# Altium project project.PrjPcb
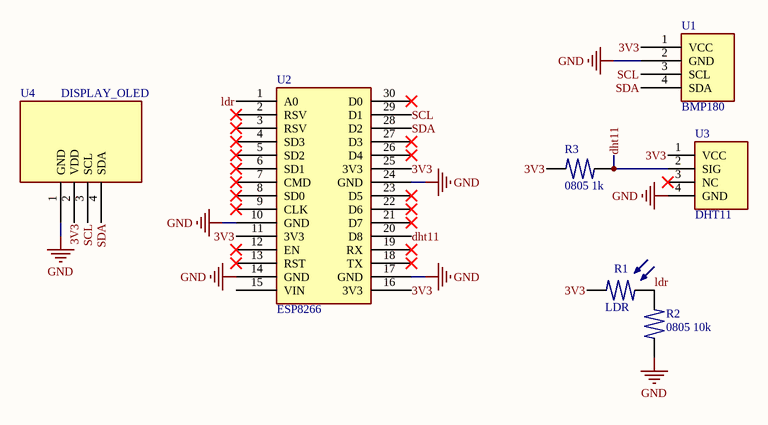
[diagram p0: schematic.SchDoc]
1 sheet, 7 parts. Net scope: global (net labels, ports and power ports of the same name join across sheets).
Board file: pcb.PcbDoc

## Sheet schematic.SchDoc
size A4; SheetNumber: 1; SheetTotal: 1

### Parts
R1  LDR  [LDR]
R2  0805 10k  [RESISTOR_0805]
R3  0805 1k  [RESISTOR_0805]
U1  BMP180  [BMP180]
U2  ESP8266  [ESP8266]
U3  DHT11  [DHT11]
U4  DISPLAY_OLED  [DISPLAY_OLED]

### Nets
GND: R2.1 U1.2(GND) U2.10(GND) U2.14(GND) U2.17(GND) U2.24(GND) U3.4(GND) U4.1(GND)
3V3: R1.1 R3.1 U1.1(VCC) U2.11(3V3) U2.16(3V3) U2.25(3V3) U3.1(VCC) U4.2(VDD)
dht11: R3.2 U2.20(D8) U3.2(SIG)
ldr: R1.2 R2.2 U2.1(A0)
SCL: U1.3(SCL) U2.29(D1) U4.3(SCL)
SDA: U1.4(SDA) U2.28(D2) U4.4(SDA)

Not connected (* = marked no-connect by the designer): U2 2(RSV)* 3(RSV)* 4(SD3)* 5(SD2)* 6(SD1)* 7(CMD)* 8(SD0)* 9(CLK)* 12(EN)* 13(RST)* 15(VIN) 18(TX)* 19(RX)* 21(D7)* 22(D6)* 23(D5)* 26(D4)* 27(D3)* 30(D0)*; U3 3(NC)*

### Library data of the parts
R1 = LDR: LIGHT DEPENDEND RESISTOR/PHOTORESITOR; Digikey PN: PDV-P8107-ND
R2 R3 = RESISTOR_0805
U1 = BMP180: SENSOR ATMOSPHERIC PRESSURE/TEMPERATURE
U2 = ESP8266: Microcontoller Board 30 Pins Wifi 2.4GHz BLE 4.2 ESP-12F; ComponentLink1Description: Datasheet; ComponentLink1URL: https://docs.ai-thinker.com/_media/esp8266/docs/esp-12f_product_specification_en.pdf
U3 = DHT11: SENSOR HUMIDITY/TEMPERATURE; Digikey PN: 1528-1228-ND